# Altium schematic sheet 230VAC Power.SchDoc
size A4; SheetNumber: 6; SheetTotal: 6
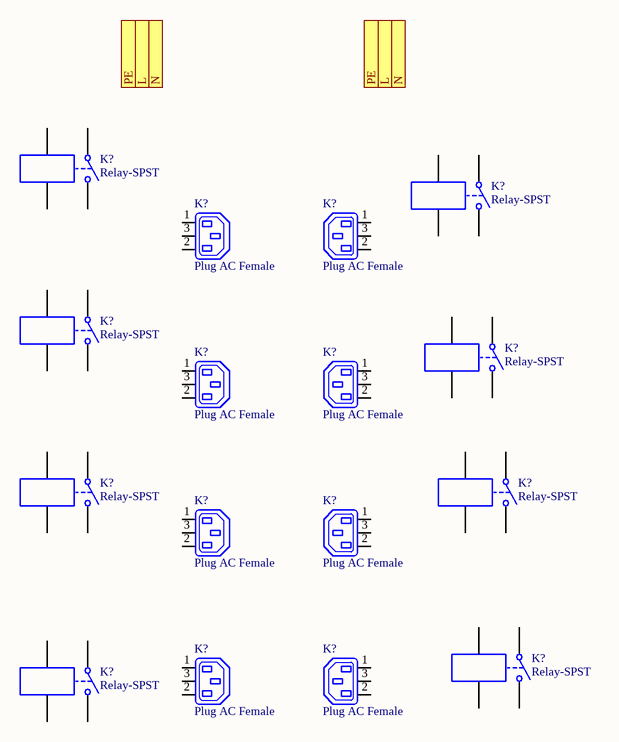
[diagram p0: 230VAC Power.SchDoc]

## Parts
(Parts that share a designator on the sheet are numbered #1, #2 ... from top to bottom, then left to right.)
K?#1  Relay-SPST  [MODULE4]
K?#2  Relay-SPST  [MODULE4]
K?#3  Plug AC Female  [IEC7-2H3]
K?#4  Plug AC Female  [IEC7-2H3]
K?#5  Relay-SPST  [MODULE4]
K?#6  Relay-SPST  [MODULE4]
K?#7  Plug AC Female  [IEC7-2H3]
K?#8  Plug AC Female  [IEC7-2H3]
K?#9  Relay-SPST  [MODULE4]
K?#10  Relay-SPST  [MODULE4]
K?#11  Plug AC Female  [IEC7-2H3]
K?#12  Plug AC Female  [IEC7-2H3]
K?#13  Plug AC Female  [IEC7-2H3]
K?#14  Plug AC Female  [IEC7-2H3]
K?#15  Relay-SPST  [MODULE4]
K?#16  Relay-SPST  [MODULE4]

## Ports
L (in), N (in), PE (in)

## Nets

Not connected (* = marked no-connect by the designer): K?#1 1 2 3 4; K?#2 1 2 3 4; K?#3 1(L) 2(N) 3(E); K?#4 1(L) 2(N) 3(E); K?#5 1 2 3 4; K?#6 1 2 3 4; K?#7 1(L) 2(N) 3(E); K?#8 1(L) 2(N) 3(E); K?#9 1 2 3 4; K?#10 1 2 3 4; K?#11 1(L) 2(N) 3(E); K?#12 1(L) 2(N) 3(E); K?#13 1(L) 2(N) 3(E); K?#14 1(L) 2(N) 3(E); K?#15 1 2 3 4; K?#16 1 2 3 4

## Notes on the sheet
- Bahnhöheweg 70
- ICT Berufsbildungscenter AG
- Bereich Elektronik
- Datum:
- Version:
- Blattgrösse:
- Blattnummer:
- A4
- /
- 3018 Bern
- Dateiname:

## Library data of the parts
K?#1 K?#2 K?#5 K?#6 K?#9 K?#10 K?#15 K?#16 = Relay-SPST: Single-Pole Single-Throw Relay; Published: 24-Mar-1999; LatestRevisionDate: 17-Jul-2002; LatestRevisionNote: Re-released for DXP Platform.; PackageReference: MODULE4; Publisher: Altium Limited
K?#3 K?#4 K?#7 K?#8 K?#11-K?#14 = Plug AC Female: IEC Mains Power Outlet, EN60 320-2-2 F Class I, PC Flange Rear Mount, Chassis Socket; PackageDocument: ver.80, 15-Sep-2003; MaximumRating: 10A, 250V a.c. (UL & CSA 15A, 250V a.c.); MountingFixtures: Not drawn on schematic symbol.; PCB_Layout: Complies with manufacturer's recommendation.; DrillSize: Corresponds to nominal value.; Published: 15-Jul-2004; LatestRevisionDate: 15-Jul-2004; LatestRevisionNote: Component Replaced & renamed from "Phonejack".; DatasheetDocument: ver.80, 15-Sep-2003; PackageReference: PX0675/PC; Publisher: Altium Limited; Terminations: P.C. Spills; ComponentLink1Description: Manufacturer Link; ComponentLink1URL: http://www.bulgin.co.uk/